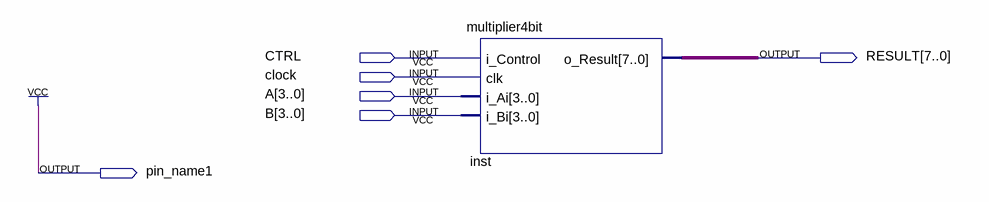
[diagram p0: schematic sheet]
// Quartus schematic testblock.bdf as structural Verilog: 1 symbols, 6 pins
module testblock (
  input  CTRL,
  input  clock,
  input  [3:0] A,
  input  [3:0] B,
  output [7:0] RESULT,
  output pin_name1
);

  multiplier4bit inst (.i_Control(CTRL), .clk(clock), .i_Ai(A), .i_Bi(B), .o_Result(RESULT));

  assign pin_name1 = 1'b1;
endmodule
